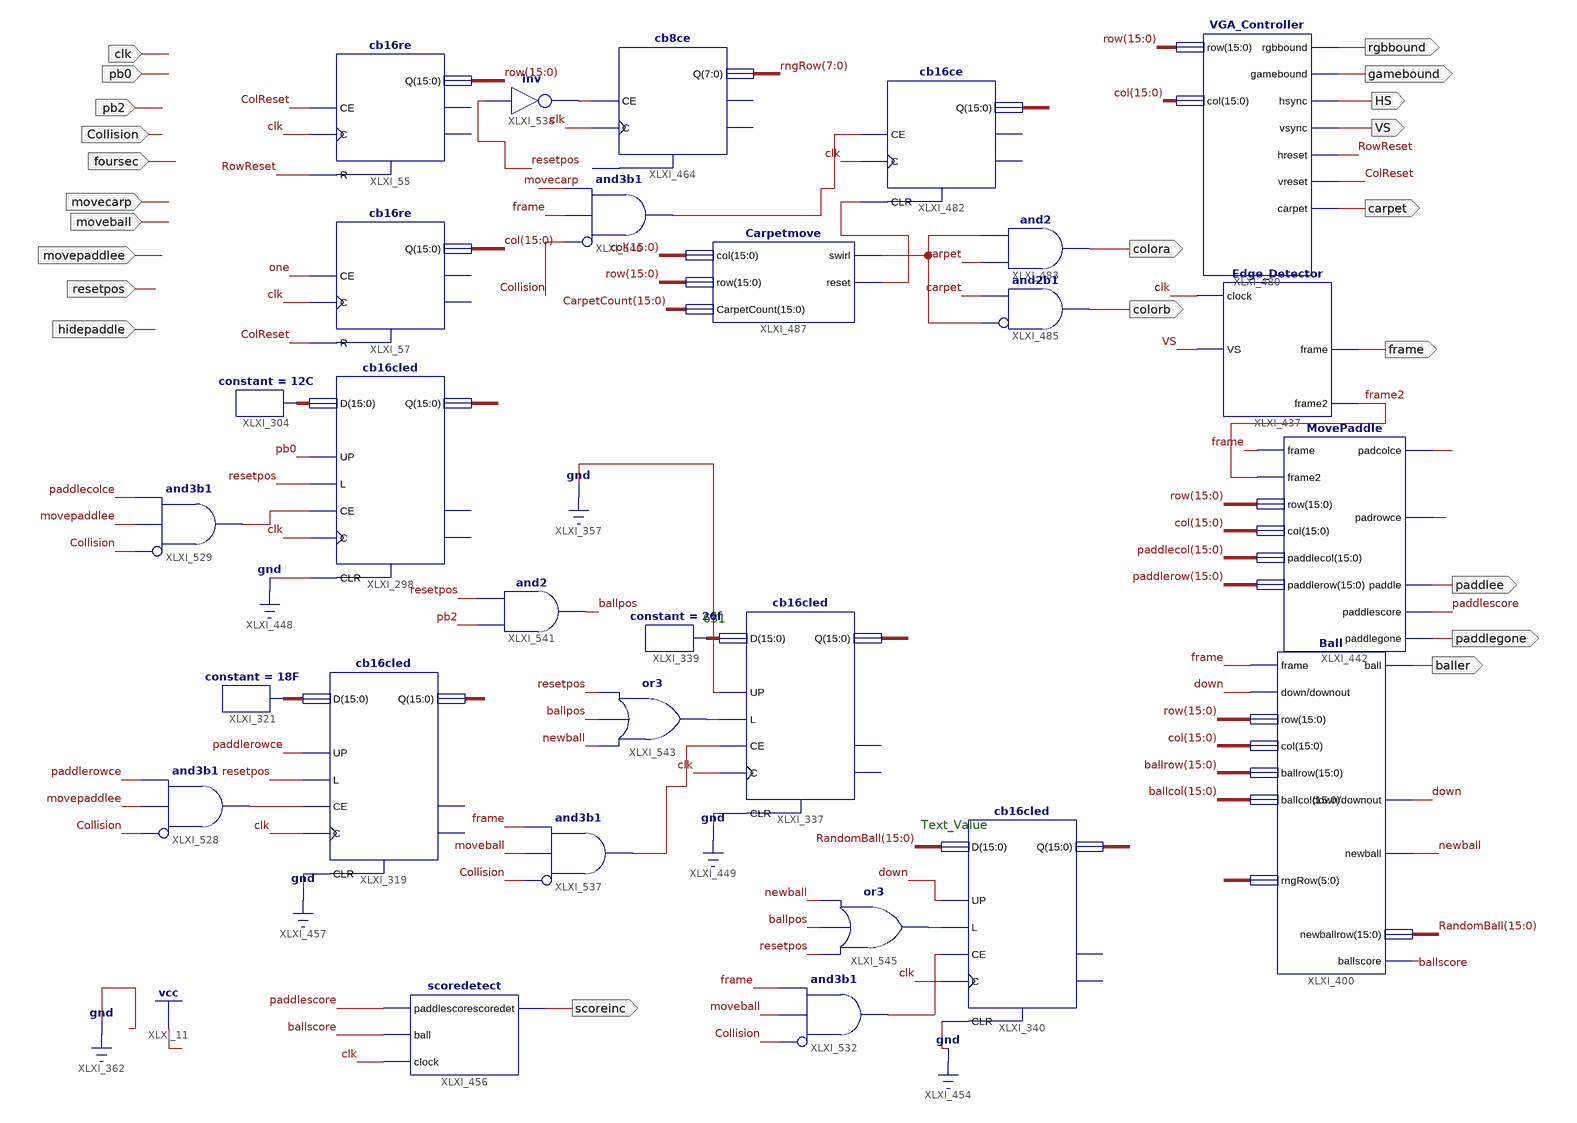
[diagram p0: schematic sheet 1]
// Xilinx ISE schematic Pixels.sch (spartan3e) as structural Verilog: 28 symbols, 22 ports
module Pixels (
  input  clk,
  input  pb0,
  input  pb2,
  input  Collision,
  input  foursec,
  input  moveball,
  input  movepaddlee,
  input  movecarp,
  input  resetpos,
  input  hidepaddle,
  output VS,
  output frame,
  output baller,
  output paddlee,
  output scoreinc,
  output HS,
  output rgbbound,
  output gamebound,
  output carpet,
  output colora,
  output colorb,
  output paddlegone
);

  wire ballpos, ballscore, ColReset, down, frame2, newball, paddlecolce, paddlerowce, paddlescore, RowReset,
       XLXN_953, XLXN_1021, XLXN_1025, XLXN_1026, XLXN_1160, XLXN_1161, XLXN_1248, XLXN_1252, XLXN_1255,
       XLXN_1256;
  wire [7:0] rngRow;
  wire [15:0] ballcol, ballrow, CarpetCount, col, paddlecol, paddlerow, RandomBall, row, XLXN_762, XLXN_800,
       XLXN_876;

  cb16re XLXI_57 (.C(clk), .CE(1'b1), .R(ColReset), .Q(col));  // open: CEO, TC
  cb16re XLXI_55 (.C(clk), .CE(ColReset), .R(RowReset), .Q(row));  // open: CEO, TC
  Ball XLXI_400 (
    .frame(frame), .down(down), .row(row), .col(col), .ballrow(ballrow), .ballcol(ballcol),
    .rngRow(rngRow[5:0]), .ball(baller), .downout(down), .newball(newball), .newballrow(RandomBall),
    .ballscore(ballscore));
  cb16cled XLXI_298 (
    .C(clk), .CE(XLXN_1026), .CLR(1'b0), .D(XLXN_762), .L(resetpos), .UP(pb0), .Q(paddlecol));  // open: CEO, TC
  constant #(.CValue("12C")) XLXI_304 (.O(XLXN_762));
  constant #(.CValue("18F")) XLXI_321 (.O(XLXN_800));
  cb16cled XLXI_319 (
    .C(clk), .CE(XLXN_1021), .CLR(1'b0), .D(XLXN_800), .L(resetpos), .UP(paddlerowce), .Q(paddlerow));  // open: CEO, TC
  Edge_Detector XLXI_437 (.clock(clk), .VS(VS), .frame(frame), .frame2(frame2));
  MovePaddle XLXI_442 (
    .frame(frame), .frame2(frame2), .row(row), .col(col), .paddlecol(paddlecol), .paddlerow(paddlerow),
    .padcolce(paddlecolce), .padrowce(paddlerowce), .paddle(paddlee), .paddlescore(paddlescore),
    .paddlegone(paddlegone));
  scoredetect XLXI_456 (.paddlescore(paddlescore), .ball(ballscore), .scoredet(scoreinc), .clock(clk));
  cb8ce XLXI_464 (.C(clk), .CE(XLXN_1252), .Q(rngRow));  // open: CLR, CEO, TC
  VGA_Controller XLXI_480 (
    .row(row), .col(col), .rgbbound(rgbbound), .gamebound(gamebound), .hsync(HS), .vsync(VS),
    .hreset(RowReset), .vreset(ColReset), .carpet(carpet));
  cb16ce XLXI_482 (.C(clk), .CE(XLXN_1248), .CLR(XLXN_1160), .Q(CarpetCount));  // open: CEO, TC
  and XLXI_483 (colora, carpet, XLXN_1161);
  and XLXI_485 (colorb, ~XLXN_1161, carpet);  // and2b1
  Carpetmove XLXI_487 (.col(col), .row(row), .CarpetCount(CarpetCount), .swirl(XLXN_1161), .reset(XLXN_1160));
  cb16cled XLXI_340 (
    .C(clk), .CE(XLXN_953), .CLR(1'b0), .D(RandomBall), .L(XLXN_1256), .UP(down), .Q(ballrow));  // open: CEO, TC
  cb16cled XLXI_337 (
    .C(clk), .CE(XLXN_1025), .CLR(1'b0), .D(XLXN_876), .L(XLXN_1255), .UP(1'b0), .Q(ballcol));  // open: CEO, TC
  constant #(.CValue("26f")) XLXI_339 (.O(XLXN_876));
  and XLXI_529 (XLXN_1026, ~Collision, movepaddlee, paddlecolce);  // and3b1
  and XLXI_532 (XLXN_953, ~Collision, moveball, frame);  // and3b1
  and XLXI_528 (XLXN_1021, ~Collision, movepaddlee, paddlerowce);  // and3b1
  and XLXI_537 (XLXN_1025, ~Collision, moveball, frame);  // and3b1
  not XLXI_538 (XLXN_1252, resetpos);
  and XLXI_541 (ballpos, pb2, resetpos);
  or XLXI_543 (XLXN_1255, newball, ballpos, resetpos);
  or XLXI_545 (XLXN_1256, resetpos, ballpos, newball);
  and XLXI_546 (XLXN_1248, ~Collision, frame, movecarp);  // and3b1

  // Notes on the sheet:
  //   631
  //   Text_Value
endmodule
